# Altium schematic sheet Res 100K 50V.schdoc
size 127 x 99 mm
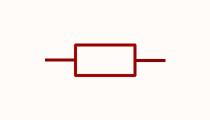
[diagram p0: Res 100K 50V.schdoc]

## Parts
R?  100kΩ  [R0402]  (value not drawn)

## Nets

Not connected (* = marked no-connect by the designer): R? 1 2

## Library data of the parts
R? = ERA2AEB104X: Manufacturer: PANASONIC(松下); Add into BOM: yes; Tolerance: ±0.1%; Temperature Coefficient: ±25ppm/℃; Symbol: ERA2AEB104X; Device: ERA2AEB104X; LCSC Part Name: 100kΩ ±0.1% 63mW 薄膜电阻; Supplier Part: C445619; Manufacturer Part: ERA2AEB104X; Supplier Footprint: 0402; JLCPCB Part Class: Extended Part; Supplier: LCSC; Convert to PCB: yes; Type: Thin Film Resistor; Value: 100kΩ; Operating Temperature Range: -55℃~+155℃